# EAGLE design Moteino-MH-z19-Shield (EAGLE 8.2.1)
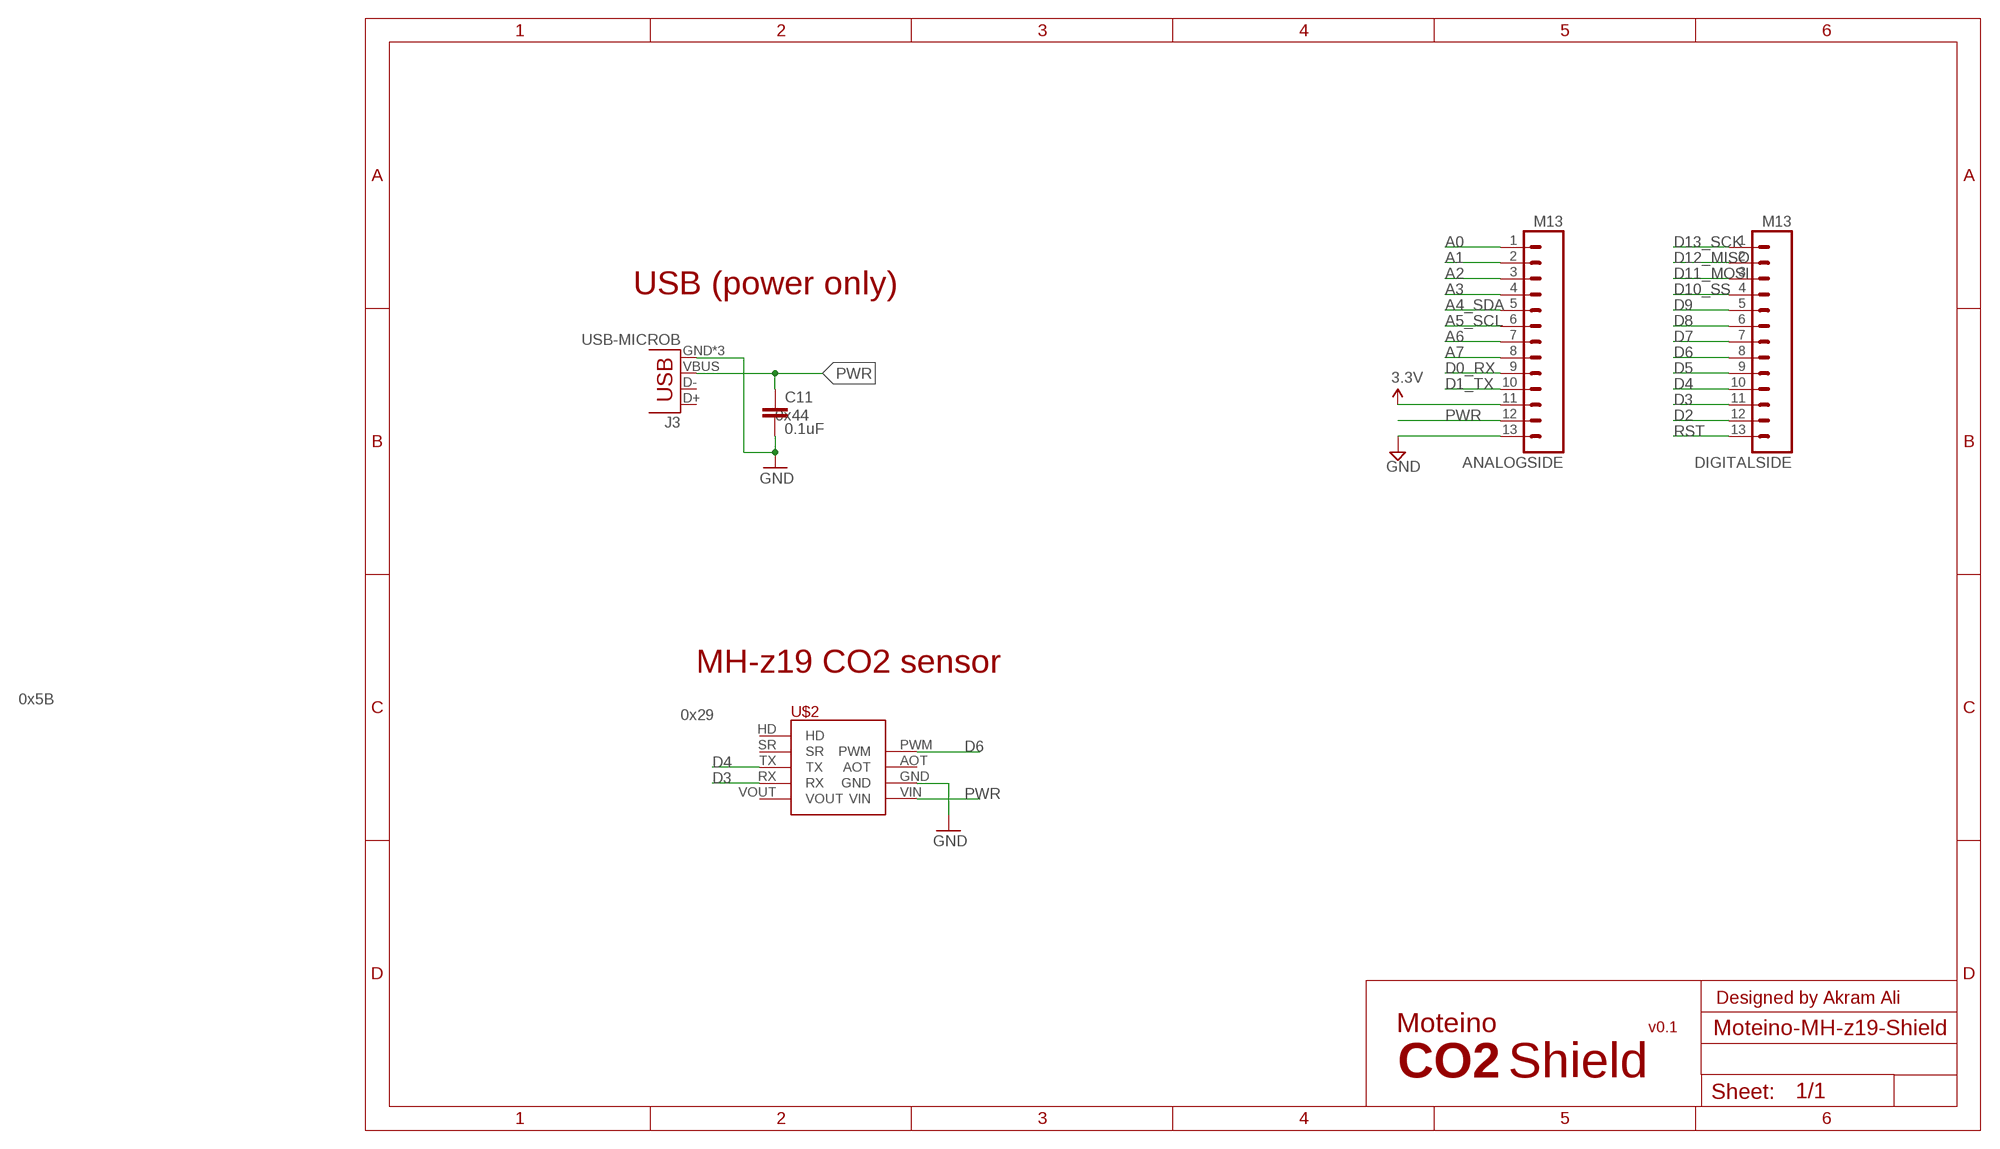
[diagram p0: schematic, sheet 1]

## Parts
ANALOGSIDE  M13  [1X13]
C11  0.1uF  CAP0805  [0805]
DIGITALSIDE  M13  [1X13]
J3  USB-MICROB  [USB-MICROB]
U$2  MH-Z19  [MH-Z19]

## Nets
A0: ANALOGSIDE.1
A1: ANALOGSIDE.2
A2: ANALOGSIDE.3
A3: ANALOGSIDE.4
A4_SDA: ANALOGSIDE.5
A5_SCL: ANALOGSIDE.6
A6: ANALOGSIDE.7
A7: ANALOGSIDE.8
D0_RX: ANALOGSIDE.9
D1_TX: ANALOGSIDE.10
D2: DIGITALSIDE.12
D3: DIGITALSIDE.11 U$2.RX
D4: DIGITALSIDE.10 U$2.TX
D5: DIGITALSIDE.9
D6: DIGITALSIDE.8 U$2.PWM
D7: DIGITALSIDE.7
D8: DIGITALSIDE.6
D9: DIGITALSIDE.5
D10_SS: DIGITALSIDE.4
D11_MOSI: DIGITALSIDE.3
D12_MISO: DIGITALSIDE.2
D13_SCK: DIGITALSIDE.1
GND [power]: ANALOGSIDE.13 C11.2 J3.GND J3.MT1(GND) J3.MT2(GND) U$2.GND
PWR [power]: ANALOGSIDE.12 C11.1 J3.VBUS U$2.VIN
RST: DIGITALSIDE.13
VCC: ANALOGSIDE.11 ; supply symbol labelled 3.3V
Unconnected: J3.D+ J3.D- U$2.AOT U$2.HD U$2.SR U$2.VOUT

## Notes on the sheet
- USB (power only)
- 0x44
- MH-z19 CO2 sensor
- 0x5B
- 0x29
- Designed by Akram Ali
- Moteino | v0.1
- CO2 | Shield

## Library data of the parts
ANALOGSIDE DIGITALSIDE = SparkFun-Connectors:M13: 13-pin single row .1" header
C11 = SparkFun-Capacitors:CAP: Capacitor Standard 0603 ceramic capacitor, and 0.1" leaded capacitor.; MPN: CC0805KRX7R9BB104
J3 = SparkFun-Connectors:USB: USB Connectors USB-B-PTH is fully proven SKU : PRT-00139/CONN-08278 USB-miniB is fully proven SKU : PRT-00587 USB-A-PCB is untested. USB-A-H is throughly reviewed, but untested. Spark Fun Electronics SKU : PRT-00437 USB-B-SMT is throughly reviewed, but untested. Needs silkscreen touching up. USB-A-S has not been used/tested USB-MB-H has not been used/tested USB-MICROB has been used. CONN-09505; MPN: 47346-0001; PROD_ID: CONN-09505
U$2 = MH-z19:MH-Z19: MH-z19 Footprint EAGLE footprint of MH-z19 CO2 sensor. Designed by AKstudios github.com/akstudios

## Net classes
1 power: width 0.381 mm, clearance 0.254 mm

## Board
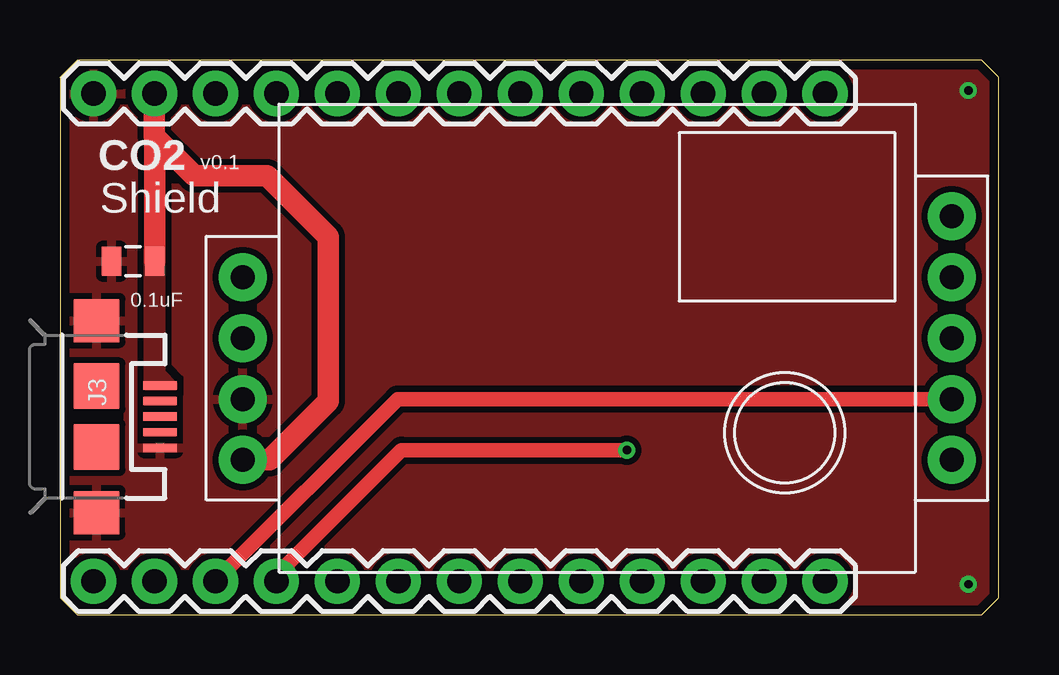
[diagram p1: board, top side]
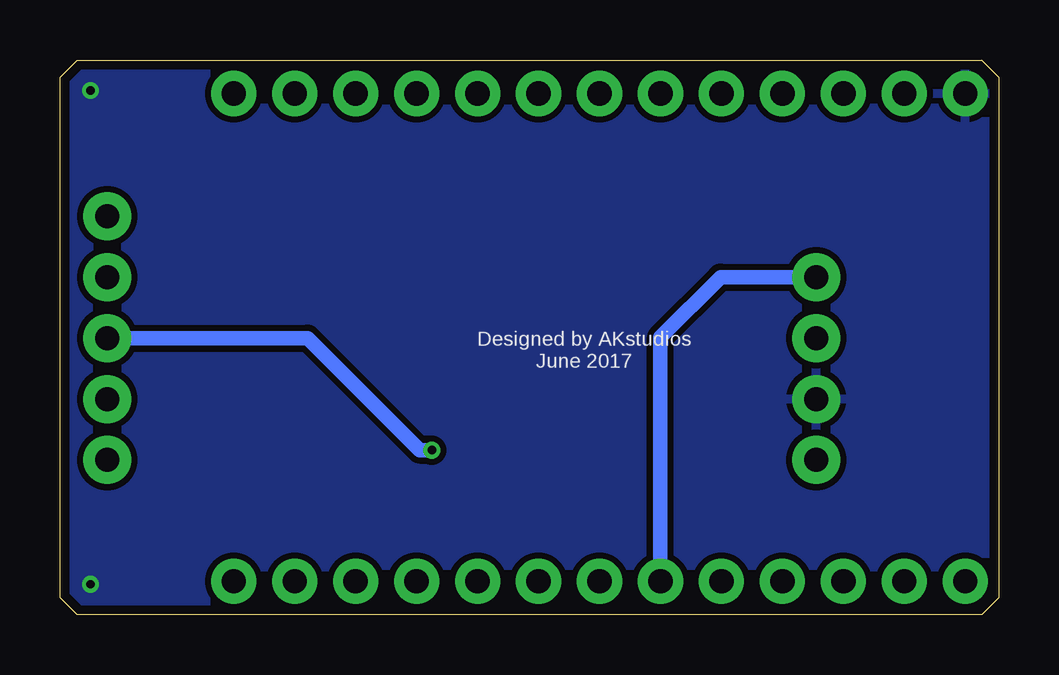
[diagram p2: board, bottom side, seen from below]

Size 39.12 x 23.11 mm. Coordinates in mm from the lower left corner, seen from the top.
Outline: 0.71,0 38.41,0 39.12,0.71 39.12,22.4 38.41,23.11 0.71,23.11 0,22.4 0,0.71 0.71,0
Copper layers (1*16): Top 0.0356mm / dielectric 1.5011mm / Bottom 0.0356mm
Design rules "oshpark-2layer": minimum track width 6mil, minimum drill 13mil, track to track 6mil, track to pad 6mil, pad to pad 6mil, via to via 6mil, smd to smd 6mil, copper to edge 15mil, drill to drill 6mil, minimum pad ring 7mil, minimum via ring 7mil, stop-mask expansion 2.5mil, vias tented up to drill 0mil, thermal gap 10mil

### Footprints (pad centres in the part's own frame; a part is rotated, then mirrored left to right if it is on the bottom)
1X13 = drill 1.016 pad 1.88: 1 0,0; 2 2.54,0; 3 5.08,0; 4 7.62,0; 5 10.16,0; 6 12.7,0; 7 15.24,0; 8 17.78,0; 9 20.32,0; 10 22.86,0; 11 25.4,0; 12 27.94,0; 13 30.48,0
0805 = smd 0.8 x 1.2: 1 -0.9,0; 2 0.9,0
USB-MICROB = smd 0.35 x 1.4: D+ 0,2.65; D- -0.65,2.65; GND 1.3,2.65; ID 0.65,2.65; VBUS -1.3,2.65 | smd 1.8 x 1.9: MT1 -4,0; MT2 4,0 | smd 1.9 x 1.9: P$1 -1.27,0; P$2 1.27,0
MH-Z19 = drill 1 pad 2: AOT 1.515,9.75; GND 1.515,7.21; HD 31.055,14.83; PWM 1.515,12.29; RX 31.055,7.21; SR 31.055,12.29; TX 31.055,9.75; VIN 1.515,4.67; VOUT 31.055,4.67

### Placement (x,y rotation side)
ANALOGSIDE  31.88,21.72 180 top
C11  3.05,14.73 180 top
DIGITALSIDE  31.88,1.4 180 top
J3  1.52,8.26 270 top
U$2  6.1,1.78 0 top

### Tracks (layer width: path | path; a pad name or v marks a point on that pad's centre or on a via)
D3
  Top 0.61: U$2.RX 14.07,8.99 DIGITALSIDE.11
D4  (via drill 0.35)
  Top 0.61: DIGITALSIDE.10 9.02,1.65 14.22,6.86 v23.62,6.86
  Bottom 0.61: v23.62,6.86 24.13,6.86 28.8,11.53 U$2.TX
D6
  Bottom 0.61: U$2.PWM 11.59,14.07 14.1,11.56 DIGITALSIDE.8
GND  (via drill 0.35)
  other vias: 37.85,1.27 37.85,21.84
  pour Bottom: -0.64,24 -0.64,-0.76 39.88,-0.76 39.88,24
  pour Top (rank 6): -0.64,24 -0.64,-0.76 39.88,-0.76 39.88,24
PWR
  Top 0.813: 3.95,19.93 3.94,19.94
  Top 0.889: U$2.VIN 8.73,6.45 11.18,8.89 11.18,15.75 8.64,18.29 5.59,18.29 3.94,19.94 ANALOGSIDE.12 | 3.95,19.93 C11.1
  pour Top (no thermals): 3.56,9.4 3.56,15.24 4.32,15.24 4.32,10.16 4.83,9.65 4.83,9.4

### Text on the board
tPlace: CO2 | v0.1 | Shield
bPlace: Designed by AKstudios / June 2017
tDocu: REG